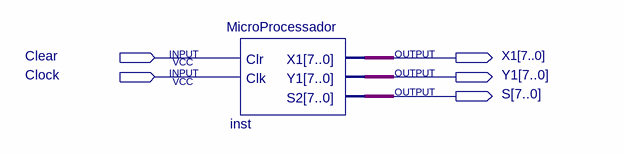
[diagram p0: schematic sheet]
// Quartus schematic Teste.bdf as structural Verilog: 1 symbols, 5 pins
module Teste (
  input  Clear,
  input  Clock,
  output [7:0] X1,
  output [7:0] Y1,
  output [7:0] S
);

  MicroProcessador inst (.Clr(Clear), .Clk(Clock), .X1(X1), .Y1(Y1), .S2(S));
endmodule
